# Altium schematic sheet Main_Board.SchDoc
size A0; Organization: Altium Limited; Address1: L3, 12a Rodborough Rd; Address2: Frenchs Forest; Address3: NSW; Address4: Australia 2086
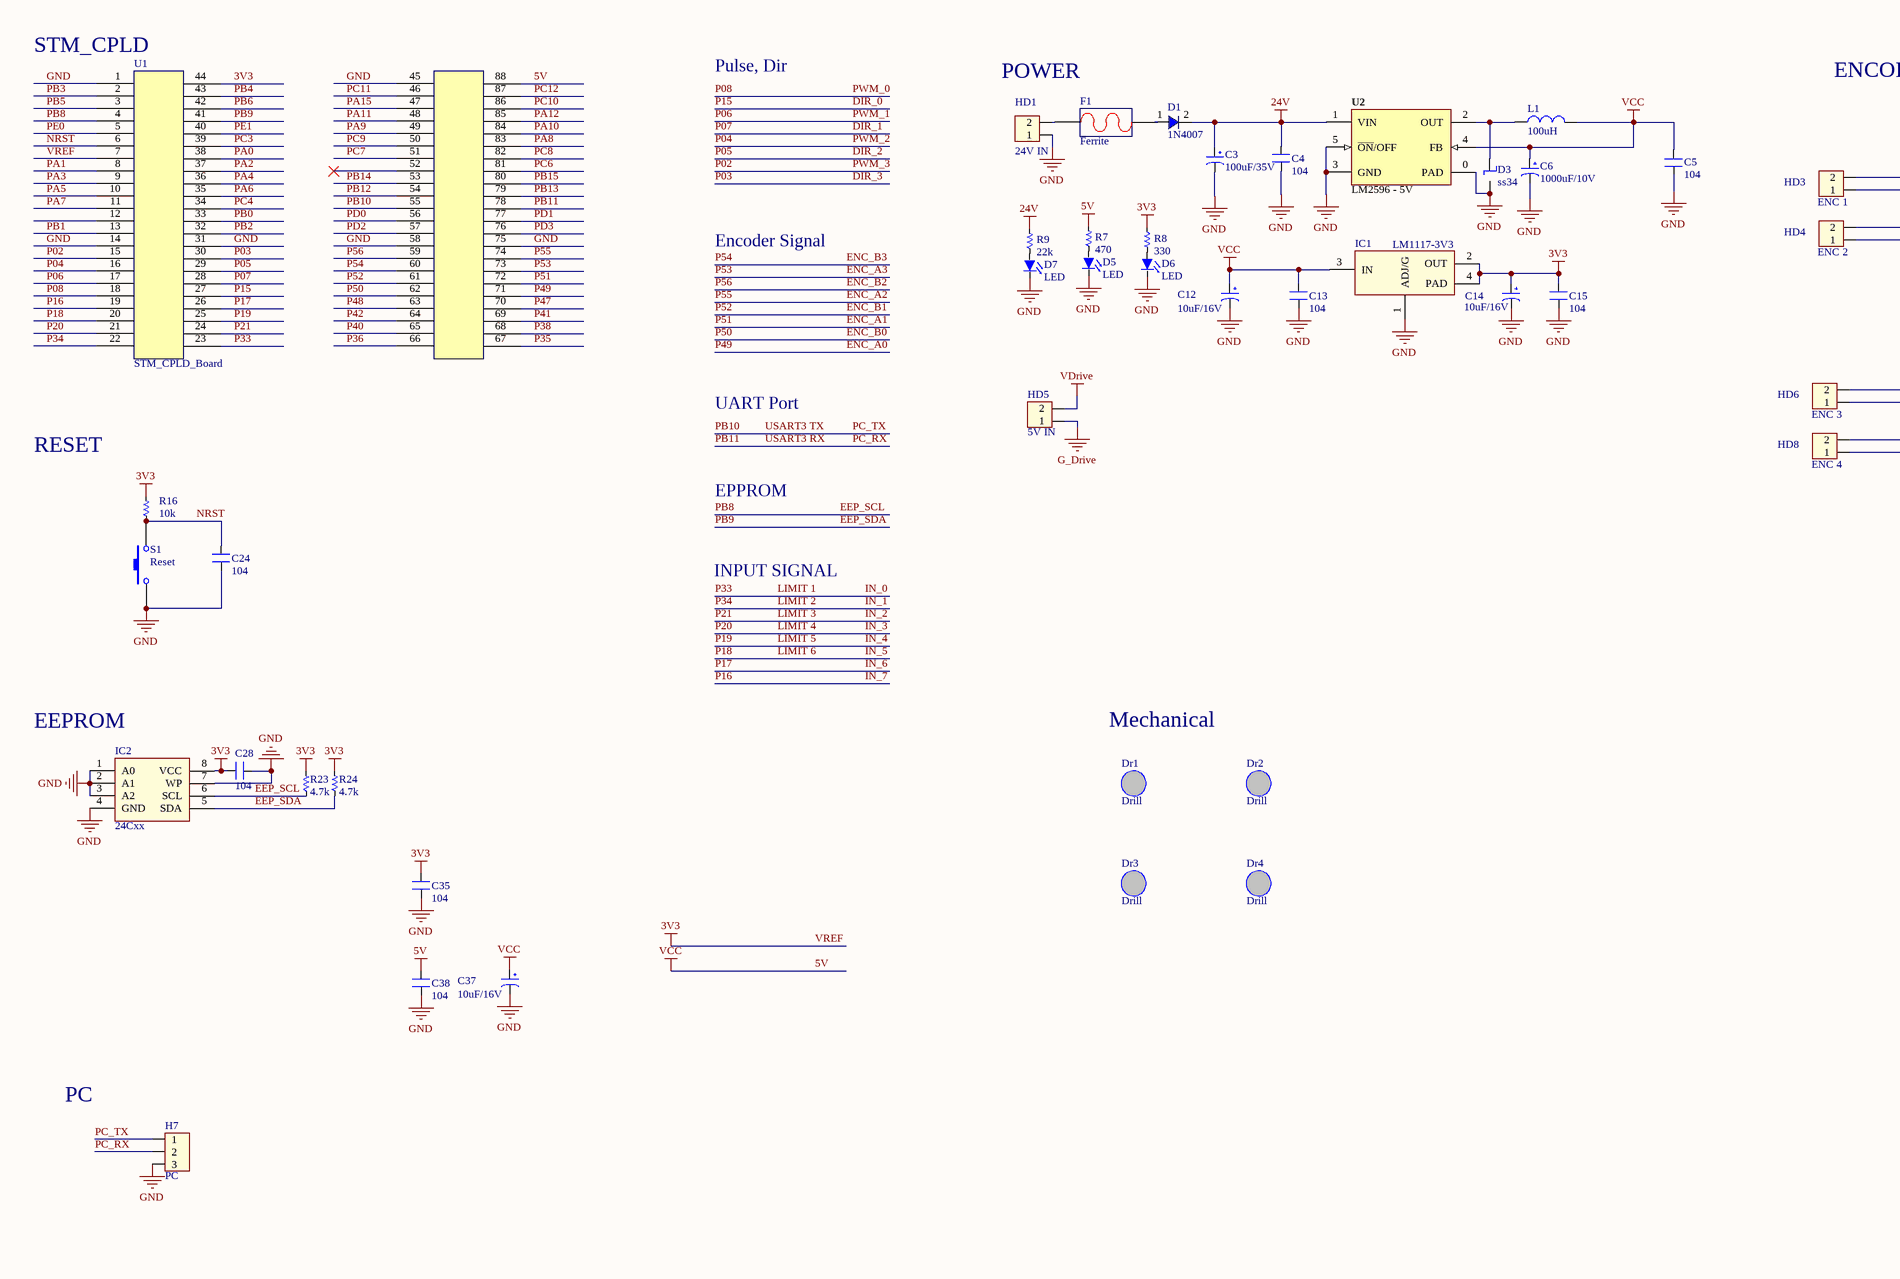
[diagram p0: Main_Board.SchDoc, top left]
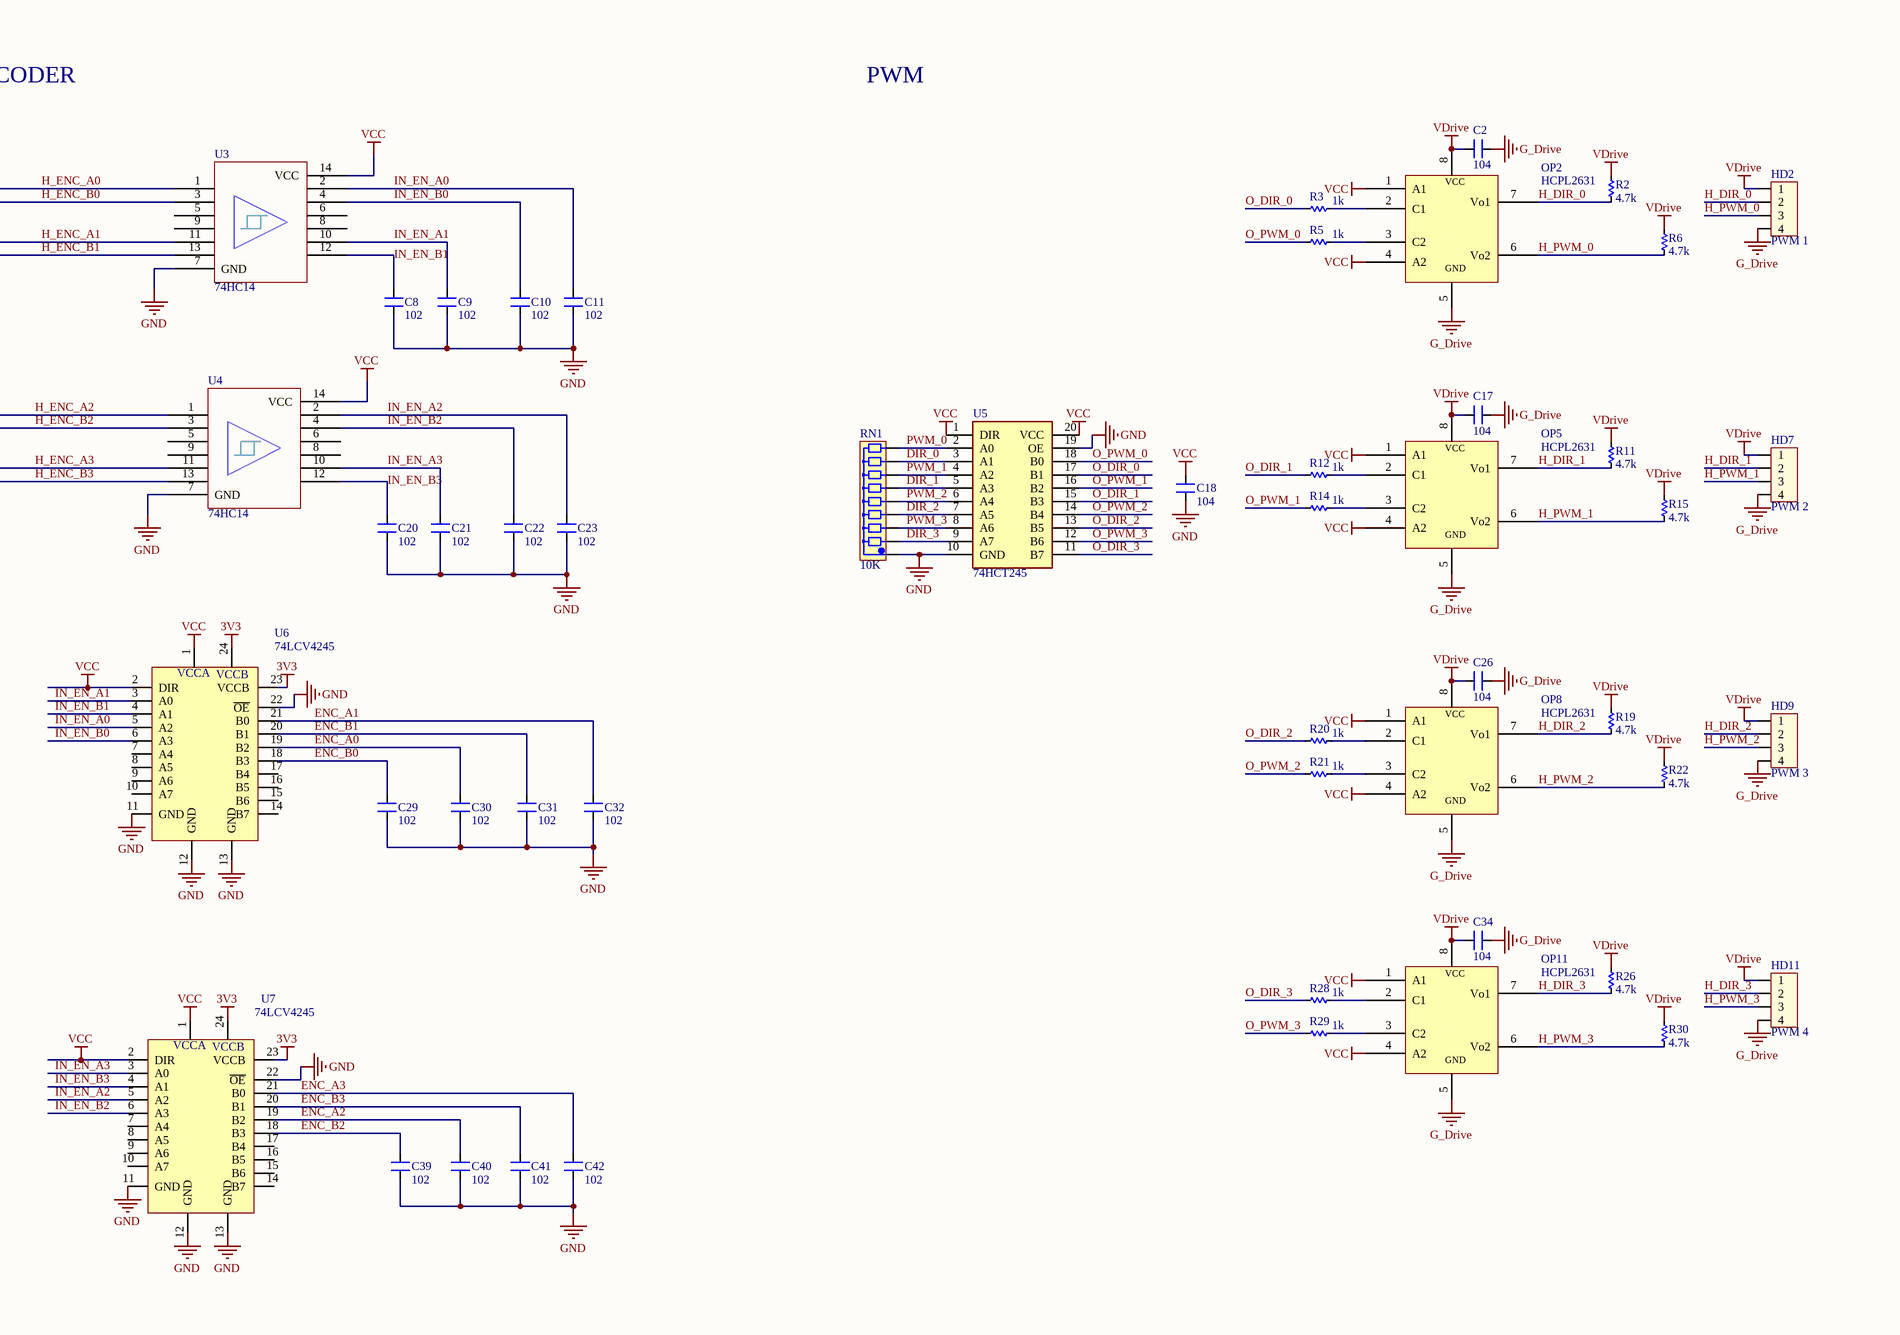
[diagram p1: Main_Board.SchDoc, top middle]
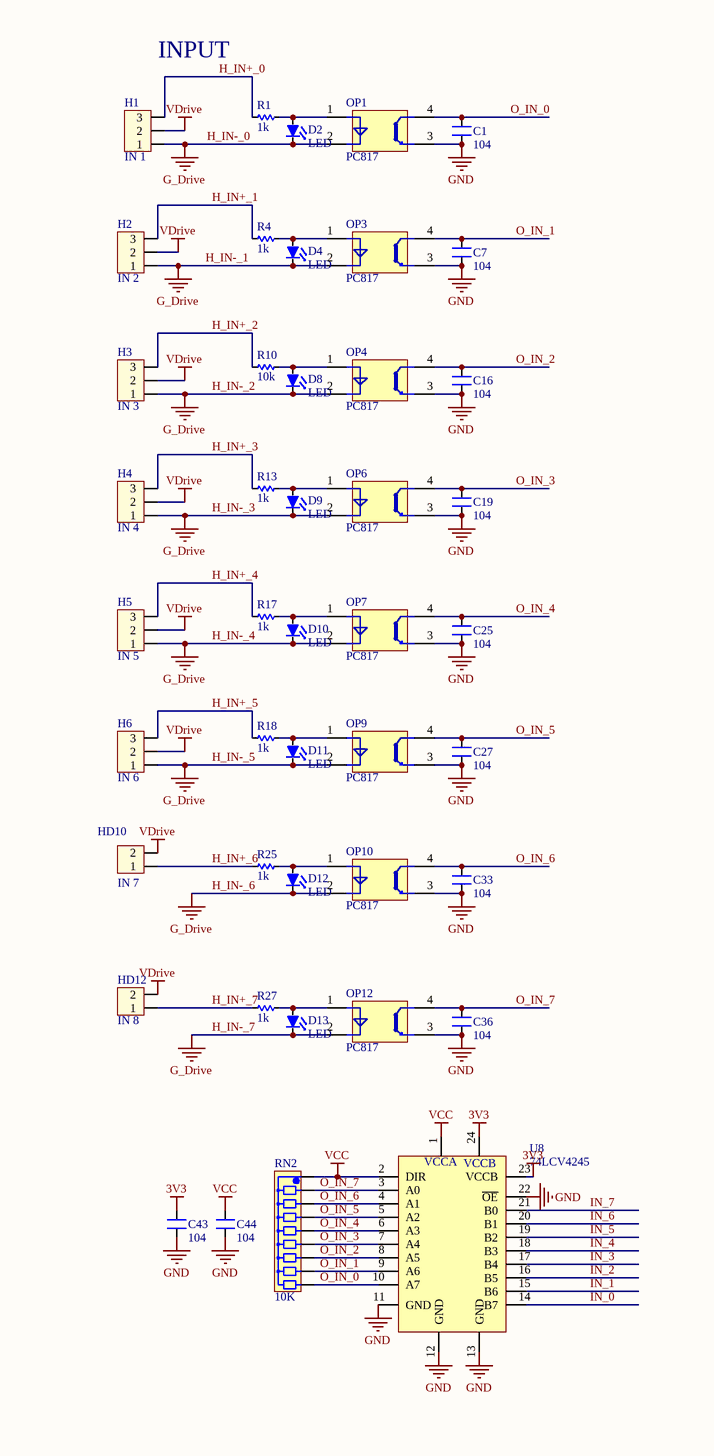
[diagram p2: Main_Board.SchDoc, top right]
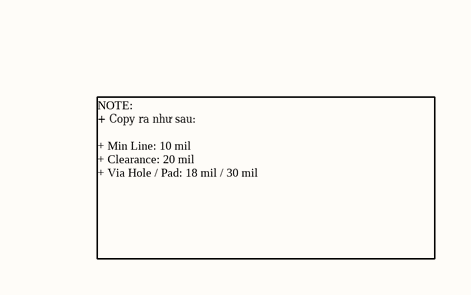
[diagram p3: Main_Board.SchDoc, bottom right]

## Parts
C1  104  [CAP-SM-0805]
C2  104  [CAP-SM-0805]
C3  100uF/35V  [Cap_Alu_D8]
C4  104  [CAP-SM-0805]
C5  104  [CAP-SM-0805]
C6  1000uF/10V  [Cap_Alu_G]
C7  104  [CAP-SM-0805]
C8  102  [CAP-SM-0805]
C9  102  [CAP-SM-0805]
C10  102  [CAP-SM-0805]
C11  102  [CAP-SM-0805]
C12  10uF/16V  [CAP_ALU_B]
C13  104  [CAP-SM-0805]
C14  10uF/16V  [CAP_ALU_B]
C15  104  [CAP-SM-0805]
C16  104  [CAP-SM-0805]
C17  104  [CAP-SM-0805]
C18  104  [CAP-SM-0805]
C19  104  [CAP-SM-0805]
C20  102  [CAP-SM-0805]
C21  102  [CAP-SM-0805]
C22  102  [CAP-SM-0805]
C23  102  [CAP-SM-0805]
C24  104  [CAP-SM-0805]
C25  104  [CAP-SM-0805]
C26  104  [CAP-SM-0805]
C27  104  [CAP-SM-0805]
C28  104  [CAP-SM-0805]
C29  102  [CAP-SM-0805]
C30  102  [CAP-SM-0805]
C31  102  [CAP-SM-0805]
C32  102  [CAP-SM-0805]
C33  104  [CAP-SM-0805]
C34  104  [CAP-SM-0805]
C35  104  [CAP-SM-0805]
C36  104  [CAP-SM-0805]
C37  10uF/16V  [CAP_ALU_B]
C38  104  [CAP-SM-0805]
C39  102  [CAP-SM-0805]
C40  102  [CAP-SM-0805]
C41  102  [CAP-SM-0805]
C42  102  [CAP-SM-0805]
C43  104  [CAP-SM-0805]
C44  104  [CAP-SM-0805]
D1  1N4007  [DO-214AB]
D2  LED  [LED_0805_Blue]
D3  ss34  [DO-214AB]
D4  LED  [LED_0805_Blue]
D5  LED  [LED_0805_Blue]
D6  LED  [LED_0805_Blue]
D7  LED  [LED_0805_Blue]
D8  LED  [LED_0805_Blue]
D9  LED  [LED_0805_Blue]
D10  LED  [LED_0805_Blue]
D11  LED  [LED_0805_Blue]
D12  LED  [LED_0805_Blue]
D13  LED  [LED_0805_Blue]
Dr1  Drill  [Drill 3mm]
Dr2  Drill  [Drill 3mm]
Dr3  Drill  [Drill 3mm]
Dr4  Drill  [Drill 3mm]
F1  Ferrite  [Ferrite]
H1  IN 1  [Header White 3]
H2  IN 2  [Header White 3]
H3  IN 3  [Header White 3]
H4  IN 4  [Header White 3]
H5  IN 5  [Header White 3]
H6  IN 6  [Header White 3]
H7  PC  [Header White 3]
HD1  24V IN  [Domino 2]
HD2  PWM 1  [Domino 4]
HD3  ENC 1  [Domino 2]
HD4  ENC 2  [Domino 2]
HD5  5V IN  [Domino 2]
HD6  ENC 3  [Domino 2]
HD7  PWM 2  [Domino 4]
HD8  ENC 4  [Domino 2]
HD9  PWM 3  [Domino 4]
HD10  IN 7  [Domino 2]
HD11  PWM 4  [Domino 4]
HD12  IN 8  [Domino 2]
IC1  LM1117-3V3  [SOT223-4N]
IC2  24Cxx  [SOIC8]
L1  100uH  [INDUCTOR_SMD]
OP1  PC817  [SOP4 2.54]
OP2  HCPL2631  [6N137SMD]
OP3  PC817  [SOP4 2.54]
OP4  PC817  [SOP4 2.54]
OP5  HCPL2631  [6N137SMD]
OP6  PC817  [SOP4 2.54]
OP7  PC817  [SOP4 2.54]
OP8  HCPL2631  [6N137SMD]
OP9  PC817  [SOP4 2.54]
OP10  PC817  [SOP4 2.54]
OP11  HCPL2631  [6N137SMD]
OP12  PC817  [SOP4 2.54]
R1  1k  [RES-SM-0805]
R2  4.7k  [RES-SM-0805]
R3  1k  [RES-SM-0805]
R4  1k  [RES-SM-0805]
R5  1k  [RES-SM-0805]
R6  4.7k  [RES-SM-0805]
R7  470  [RES-SM-0805]
R8  330  [RES-SM-0805]
R9  22k  [RES-SM-0805]
R10  10k  [RES-SM-0805]
R11  4.7k  [RES-SM-0805]
R12  1k  [RES-SM-0805]
R13  1k  [RES-SM-0805]
R14  1k  [RES-SM-0805]
R15  4.7k  [RES-SM-0805]
R16  10k  [RES-SM-0805]
R17  1k  [RES-SM-0805]
R18  1k  [RES-SM-0805]
R19  4.7k  [RES-SM-0805]
R20  1k  [RES-SM-0805]
R21  1k  [RES-SM-0805]
R22  4.7k  [RES-SM-0805]
R23  4.7k  [RES-SM-0805]
R24  4.7k  [RES-SM-0805]
R25  1k  [RES-SM-0805]
R26  4.7k  [RES-SM-0805]
R27  1k  [RES-SM-0805]
R28  1k  [RES-SM-0805]
R29  1k  [RES-SM-0805]
R30  4.7k  [RES-SM-0805]
RN1  10K  [RN8]
RN2  10K  [RN8]
S1  Reset  [SW2]
U1  STM_CPLD_Board  [STM_CPLD_Board]
U2  LM2596 - 5V  [TO263]
U3  74HC14  [SO14-150mil]
U4  74HC14  [SO14-150mil]
U5  74HCT245  [soic20]
U6  74LCV4245  [SOIC24 - wide]
U7  74LCV4245  [SOIC24 - wide]
U8  74LCV4245  [SOIC24 - wide]

## Nets
3V3: C14.1 C15.1 C28.2 C35.1 C43.2 IC1.2(OUT) IC1.4(PAD) IC2.8(VCC) R8.1 R16.1 R23.2 R24.1 U1.7 U1.44 U6.23(VCCB) U6.24(VCC(B)) U7.23(VCCB) U7.24(VCC(B)) U8.23(VCCB) U8.24(VCC(B))  [also labelled VREF]
5V: C5.2 C6.1 C12.1 C13.1 C18.2 C37.1 C38.1 C44.2 IC1.3(IN) L1.2 OP2.1(A1) OP2.4(A2) OP5.1(A1) OP5.4(A2) OP8.1(A1) OP8.4(A2) OP11.1(A1) OP11.4(A2) R7.1 RN2.1 U1.88 U2.4(FB) U3.14(VCC) U4.14(VCC) U5.1(DIR) U5.20(VCC) U6.1(VCC(A)) U6.2(DIR) U7.1(VCC(A)) U7.2(DIR) U8.1(VCC(A)) U8.2(DIR)  [also labelled VCC]
24V: C3.1 C4.1 D1.2 R9.1 U2.1(VIN)
GND: C1.1 C3.2 C4.2 C5.1 C6.2 C7.1 C8.1 C9.1 C10.1 C11.1 C12.2 C13.2 C14.2 C15.2 C16.1 C18.1 C19.1 C20.1 C21.1 C22.1 C23.1 C24.2 C25.1 C27.1 C28.1 C29.1 C30.1 C31.1 C32.1 C33.1 C35.2 C36.1 C37.2 C38.2 C39.1 C40.1 C41.1 C42.1 C43.1 C44.1 D3.2(B) D5.2(K) D6.2(K) D7.2(K) H7.3 HD1.1 IC1.1(ADJ/G) IC2.1(A0) IC2.2(A1) IC2.3(A2) IC2.4(GND) IC2.7(WP) OP1.3(C) OP3.3(C) OP4.3(C) OP6.3(C) OP7.3(C) OP9.3(C) OP10.3(C) OP12.3(C) RN1.1 S1.1 U1.1 U1.14 U1.31 U1.45 U1.58 U1.75 U2.0(PAD) U2.3(GND) U2.5(~{ON}/OFF) U3.7(GND) U4.7(GND) U5.10(GND) U5.19(OE) U6.11(GND) U6.12(GND) U6.13(GND) U6.22(~{OE}) U7.11(GND) U7.12(GND) U7.13(GND) U7.22(~{OE}) U8.11(GND) U8.12(GND) U8.13(GND) U8.22(~{OE})
H_IN-_0: C2.1 C17.1 C26.1 C34.1 D2.2(K) D4.2(K) D8.2(K) D9.2(K) D10.2(K) D11.2(K) D12.2(K) D13.2(K) H1.1 H2.1 H3.1 H4.1 H5.1 H6.1 HD2.4 HD5.1 HD7.4 HD9.4 HD11.4 OP1.2(C) OP2.5(GND) OP3.2(C) OP4.2(C) OP5.5(GND) OP6.2(C) OP7.2(C) OP8.5(GND) OP9.2(C) OP10.2(C) OP11.5(GND) OP12.2(C)  [also labelled G_Drive, H_IN-_1, H_IN-_2, H_IN-_3, H_IN-_4, H_IN-_5, H_IN-_6, H_IN-_7]
VDrive: C2.2 C17.2 C26.2 C34.2 H1.2 H2.2 H3.2 H4.2 H5.2 H6.2 HD2.1 HD5.2 HD7.1 HD9.1 HD10.2 HD11.1 HD12.2 OP2.8(VCC) OP5.8(VCC) OP8.8(VCC) OP11.8(VCC) R2.1 R6.1 R11.1 R15.1 R19.1 R22.1 R26.1 R30.1
DIR_0: RN1.8 U1.27 U5.3(A1)  [also labelled P15]
DIR_1: RN1.6 U1.28 U5.5(A3)  [also labelled P07]
DIR_2: RN1.4 U1.29 U5.7(A5)  [also labelled P05]
DIR_3: RN1.2 U1.30 U5.9(A7)  [also labelled P03]
EEP_SCL: IC2.6(SCL) R23.1 U1.4  [also labelled PB8]
EEP_SDA: IC2.5(SDA) R24.2 U1.41  [also labelled PB9]
ENC_A0: C30.2 U1.71 U6.19(B2)  [also labelled P49]
ENC_A1: C32.2 U1.72 U6.21(B0)  [also labelled P51]
ENC_A2: C40.2 U1.74 U7.19(B2)  [also labelled P55]
ENC_A3: C42.2 U1.73 U7.21(B0)  [also labelled P53]
ENC_B0: C29.2 U1.62 U6.18(B3)  [also labelled P50]
ENC_B1: C31.2 U1.61 U6.20(B1)  [also labelled P52]
ENC_B2: C39.2 U1.59 U7.18(B3)  [also labelled P56]
ENC_B3: C41.2 U1.60 U7.20(B1)  [also labelled P54]
H_DIR_0: HD2.2 OP2.7(Vo1) R2.2
H_DIR_1: HD7.2 OP5.7(Vo1) R11.2
H_DIR_2: HD9.2 OP8.7(Vo1) R19.2
H_DIR_3: HD11.2 OP11.7(Vo1) R26.2
H_ENC_A0: HD3.2 U3.1
H_ENC_A1: HD4.2 U3.11
H_ENC_A2: HD6.2 U4.1
H_ENC_A3: HD8.2 U4.11
H_ENC_B0: HD3.1 U3.3
H_ENC_B1: HD4.1 U3.13
H_ENC_B2: HD6.1 U4.3
H_ENC_B3: HD8.1 U4.13
H_IN+_0: H1.3 R1.2
H_IN+_1: H2.3 R4.2
H_IN+_2: H3.3 R10.2
H_IN+_3: H4.3 R13.2
H_IN+_4: H5.3 R17.2
H_IN+_5: H6.3 R18.2
H_IN+_6: HD10.1 R25.2
H_IN+_7: HD12.1 R27.2
H_PWM_0: HD2.3 OP2.6(Vo2) R6.2
H_PWM_1: HD7.3 OP5.6(Vo2) R15.2
H_PWM_2: HD9.3 OP8.6(Vo2) R22.2
H_PWM_3: HD11.3 OP11.6(Vo2) R30.2
IN_0: U1.23 U8.14(B7)  [also labelled LIMIT 1, P33]
IN_1: U1.22 U8.15(B6)  [also labelled LIMIT 2, P34]
IN_2: U1.24 U8.16(B5)  [also labelled LIMIT 3, P21]
IN_3: U1.21 U8.17(B4)  [also labelled LIMIT 4, P20]
IN_4: U1.25 U8.18(B3)  [also labelled LIMIT 5, P19]
IN_5: U1.20 U8.19(B2)  [also labelled LIMIT 6, P18]
IN_6: U1.26 U8.20(B1)  [also labelled P17]
IN_7: U1.19 U8.21(B0)  [also labelled P16]
IN_EN_A0: C11.2 U3.2 U6.5(A2)
IN_EN_A1: C9.2 U3.10 U6.3(A0)
IN_EN_A2: C23.2 U4.2 U7.5(A2)
IN_EN_A3: C21.2 U4.10 U7.3(A0)
IN_EN_B0: C10.2 U3.4 U6.6(A3)
IN_EN_B1: C8.2 U3.12 U6.4(A1)
IN_EN_B2: C22.2 U4.4 U7.6(A3)
IN_EN_B3: C20.2 U4.12 U7.4(A1)
NRST: C24.1 R16.2 S1.2 U1.6
O_DIR_0: R3.1 U5.17(B1)
O_DIR_1: R12.1 U5.15(B3)
O_DIR_2: R20.1 U5.13(B5)
O_DIR_3: R28.1 U5.11(B7)
O_IN_0: C1.2 OP1.4(E) RN2.9 U8.10(A7)
O_IN_1: C7.2 OP3.4(E) RN2.8 U8.9(A6)
O_IN_2: C16.2 OP4.4(E) RN2.7 U8.8(A5)
O_IN_3: C19.2 OP6.4(E) RN2.6 U8.7(A4)
O_IN_4: C25.2 OP7.4(E) RN2.5 U8.6(A3)
O_IN_5: C27.2 OP9.4(E) RN2.4 U8.5(A2)
O_IN_6: C33.2 OP10.4(E) RN2.3 U8.4(A1)
O_IN_7: C36.2 OP12.4(E) RN2.2 U8.3(A0)
O_PWM_0: R5.1 U5.18(B0)
O_PWM_1: R14.1 U5.16(B2)
O_PWM_2: R21.1 U5.14(B4)
O_PWM_3: R29.1 U5.12(B6)
P02: RN1.3 U1.15 U5.8(A6)  [also labelled PWM_3]
P04: RN1.5 U1.16 U5.6(A4)  [also labelled PWM_2]
P06: RN1.7 U1.17 U5.4(A2)  [also labelled PWM_1]
P08: RN1.9 U1.18 U5.2(A0)  [also labelled PWM_0]
P35: U1.67
P36: U1.66
P38: U1.68
P40: U1.65
P41: U1.69
P42: U1.64
P47: U1.70
P48: U1.63
PA0: U1.38
PA1: U1.8
PA2: U1.37
PA3: U1.9
PA4: U1.36
PA5: U1.10
PA6: U1.35
PA7: U1.11
PA8: U1.83
PA9: U1.49
PA10: U1.84
PA11: U1.48
PA12: U1.85
PA15: U1.47
PB0: U1.33
PB1: U1.13
PB2: U1.32
PB3: U1.2
PB4: U1.43
PB5: U1.3
PB6: U1.42
PB10: H7.1 U1.55  [also labelled PC_TX, USART3 TX]
PB11: H7.2 U1.78  [also labelled PC_RX, USART3 RX]
PB12: U1.54
PB13: U1.79
PB14: U1.53
PB15: U1.80
PC3: U1.39
PC4: U1.34
PC6: U1.81
PC7: U1.51
PC8: U1.82
PC9: U1.50
PC10: U1.86
PC11: U1.46
PC12: U1.87
PD0: U1.56
PD1: U1.77
PD2: U1.57
PD3: U1.76
PE0: U1.5
PE1: U1.40
NetD1_1: D1.1 F1.2
NetD2_1: D2.1(A) OP1.1(A) R1.1
NetD3_1: D3.1(a) L1.1 U2.2(OUT)
NetD4_1: D4.1(A) OP3.1(A) R4.1
NetD5_1: D5.1(A) R7.2
NetD6_1: D6.1(A) R8.2
NetD7_1: D7.1(A) R9.2
NetD8_1: D8.1(A) OP4.1(A) R10.1
NetD9_1: D9.1(A) OP6.1(A) R13.1
NetD10_1: D10.1(A) OP7.1(A) R17.1
NetD11_1: D11.1(A) OP9.1(A) R18.1
NetD12_1: D12.1(A) OP10.1(A) R25.1
NetD13_1: D13.1(A) OP12.1(A) R27.1
NetF1_1: F1.1 HD1.2
NetOP2_2: OP2.2(C1) R3.2
NetOP2_3: OP2.3(C2) R5.2
NetOP5_2: OP5.2(C1) R12.2
NetOP5_3: OP5.3(C2) R14.2
NetOP8_2: OP8.2(C1) R20.2
NetOP8_3: OP8.3(C2) R21.2
NetOP11_2: OP11.2(C1) R28.2
NetOP11_3: OP11.3(C2) R29.2

Not connected (* = marked no-connect by the designer): U1 12 52*; U3 5 6 8(7) 9(8); U4 5 6 8(7) 9(8); U6 7(A4) 8(A5) 9(A6) 10(A7) 14(B7) 15(B6) 16(B5) 17(B4); U7 7(A4) 8(A5) 9(A6) 10(A7) 14(B7) 15(B6) 16(B5) 17(B4)

## Notes on the sheet
- (near U1) STM_CPLD
- INPUT
- Pulse, Dir
- POWER
- ENCODER
- PWM
- Encoder Signal
- UART Port
- RESET
- EPPROM
- INPUT SIGNAL
- (near IC2) EEPROM
- Mechanical
- PC
- NOTE:
  + Copy ra như sau:
  + Min Line: 10 mil
  + Clearance: 20 mil
  + Via Hole / Pad: 18 mil / 30 mil
- Title
- Size:
- Date:
- File:
- A0
- Number:
- Time:
- Revision:
- Sheet
- of
- (in symbol 74LCV4245) VCCA

## Library data of the parts
C1 C2 C4 C5 C7-C11 C13 C15-C36 C38-C44 = CAP_SM_0805: Ceramic Capacitor SMD
C3 C6 = Cap_SM_Alu: SMD Aluminum Electrolytic Capacitor; Size D8: 100uF/35V, 220uF/16V, 330uF/6.3V; Size A: 2.2uF/35V, 3.3uF/35V, 4.7uF/25V; Size D: 47uF/25V, 100uF/16V,; Size C: 33uF/16V; Size B: 1uF/50V, 10uF/16V, 22uF/16V; Size F: 470uF/16V; Size G: 330uF/35V, 680uF/16V, 1000uF/10V
C12 C14 C37 = CP2: C 47uF/50V , 220uF/16V; Value: 47uF/16 - 50V; Description 1: 470uF/6,3V - 330uF/10V - 220uF/16V; Description 2: 100uF/25V - 35V - 47uF/50V - 22uF/100V; Description 3: 33uF => 47uF/63V - 1uF => 4,7uF/160V; Description 4: 1uF => 2,2uF/250V - 1uF/350V
D1 = Diode: General Rectifier; Link: http://www.tme.vn/Product.aspx?id=769#page=pro_info
D2 D4-D13 = LED_SMD: LED SMD
D3 = ss34: Surface Mount Schottky Barrier Rectifier
Dr1-Dr4 = Drill 3mm
F1 = Ferrite bead
H1-H7 = Header white 3: Connector 3; Value: Connector 3
HD1 HD3-HD6 HD8 HD10 HD12 = Domino 2: Domino 2 200mil; Value: Domino 2
HD2 HD7 HD9 HD11 = Domino 4: Domino 4 200mil; Value: Domino 4
IC1 = LM1117: Available in 1.8V, 2.5V, 2.85V, 3.3V, 5V, and  Adjustable Versions; Value: LM317
IC2 = 24Cxx: Standard 2-Wire Bus Interface Serial EEPROM; Value: DIP 8; Copyright by: VanDungEvn
L1 = L1: Inductor; Value: 150 mH
OP1 OP3 OP4 OP6 OP7 OP9 OP10 OP12 = PC817: OPTO
OP2 OP5 OP8 OP11 = HCPL2631: High CMR, High Speed TTL Compatible Optocouplers
R1-R30 = Res-SMD: Resistor; Manufacturer: Generic Components; Class: Passive; Published: 08/06/2000; Publisher: Altium Hobart Technology Centre
RN1 RN2 = RN8: Resistor 8 (Thanh); Value: Tro thanh 10K
S1 = SW - 2Pin: Switch button 2 pin
U1 = STM_CPLD_Board: STM32f4 and Max2 570 on one board
U2 = LM2596: SIMPLE SWITCHER® Power Converter 150-kHz - 3A Step-Down Voltage Regulator; Max Input Voltage: 12 V; Max Output Current: 3 (6.0 peak) A; Max Output Voltage: mV; Category: IC-Power; Min Input Voltage: mV; Min Output Voltage: mV; Mounting Technology: Surface Mount; Status: Unreleased; Supply Voltage: mV; Temperature Range: -40 to +125 degC
U3 U4 = 74HC14: Hex Inverters With SCHMITT-TRIGGER Inputs
U5 = 74HC245: Octal bus tranceiver; Link: http://tme.vn/Product.aspx?id=1404#page=pro_info
U6-U8 = 74LCV4245: Octal dual supply translating transceiver; 3-state